# Altium project CourseEN.PrjPcb (part 2 of 2)
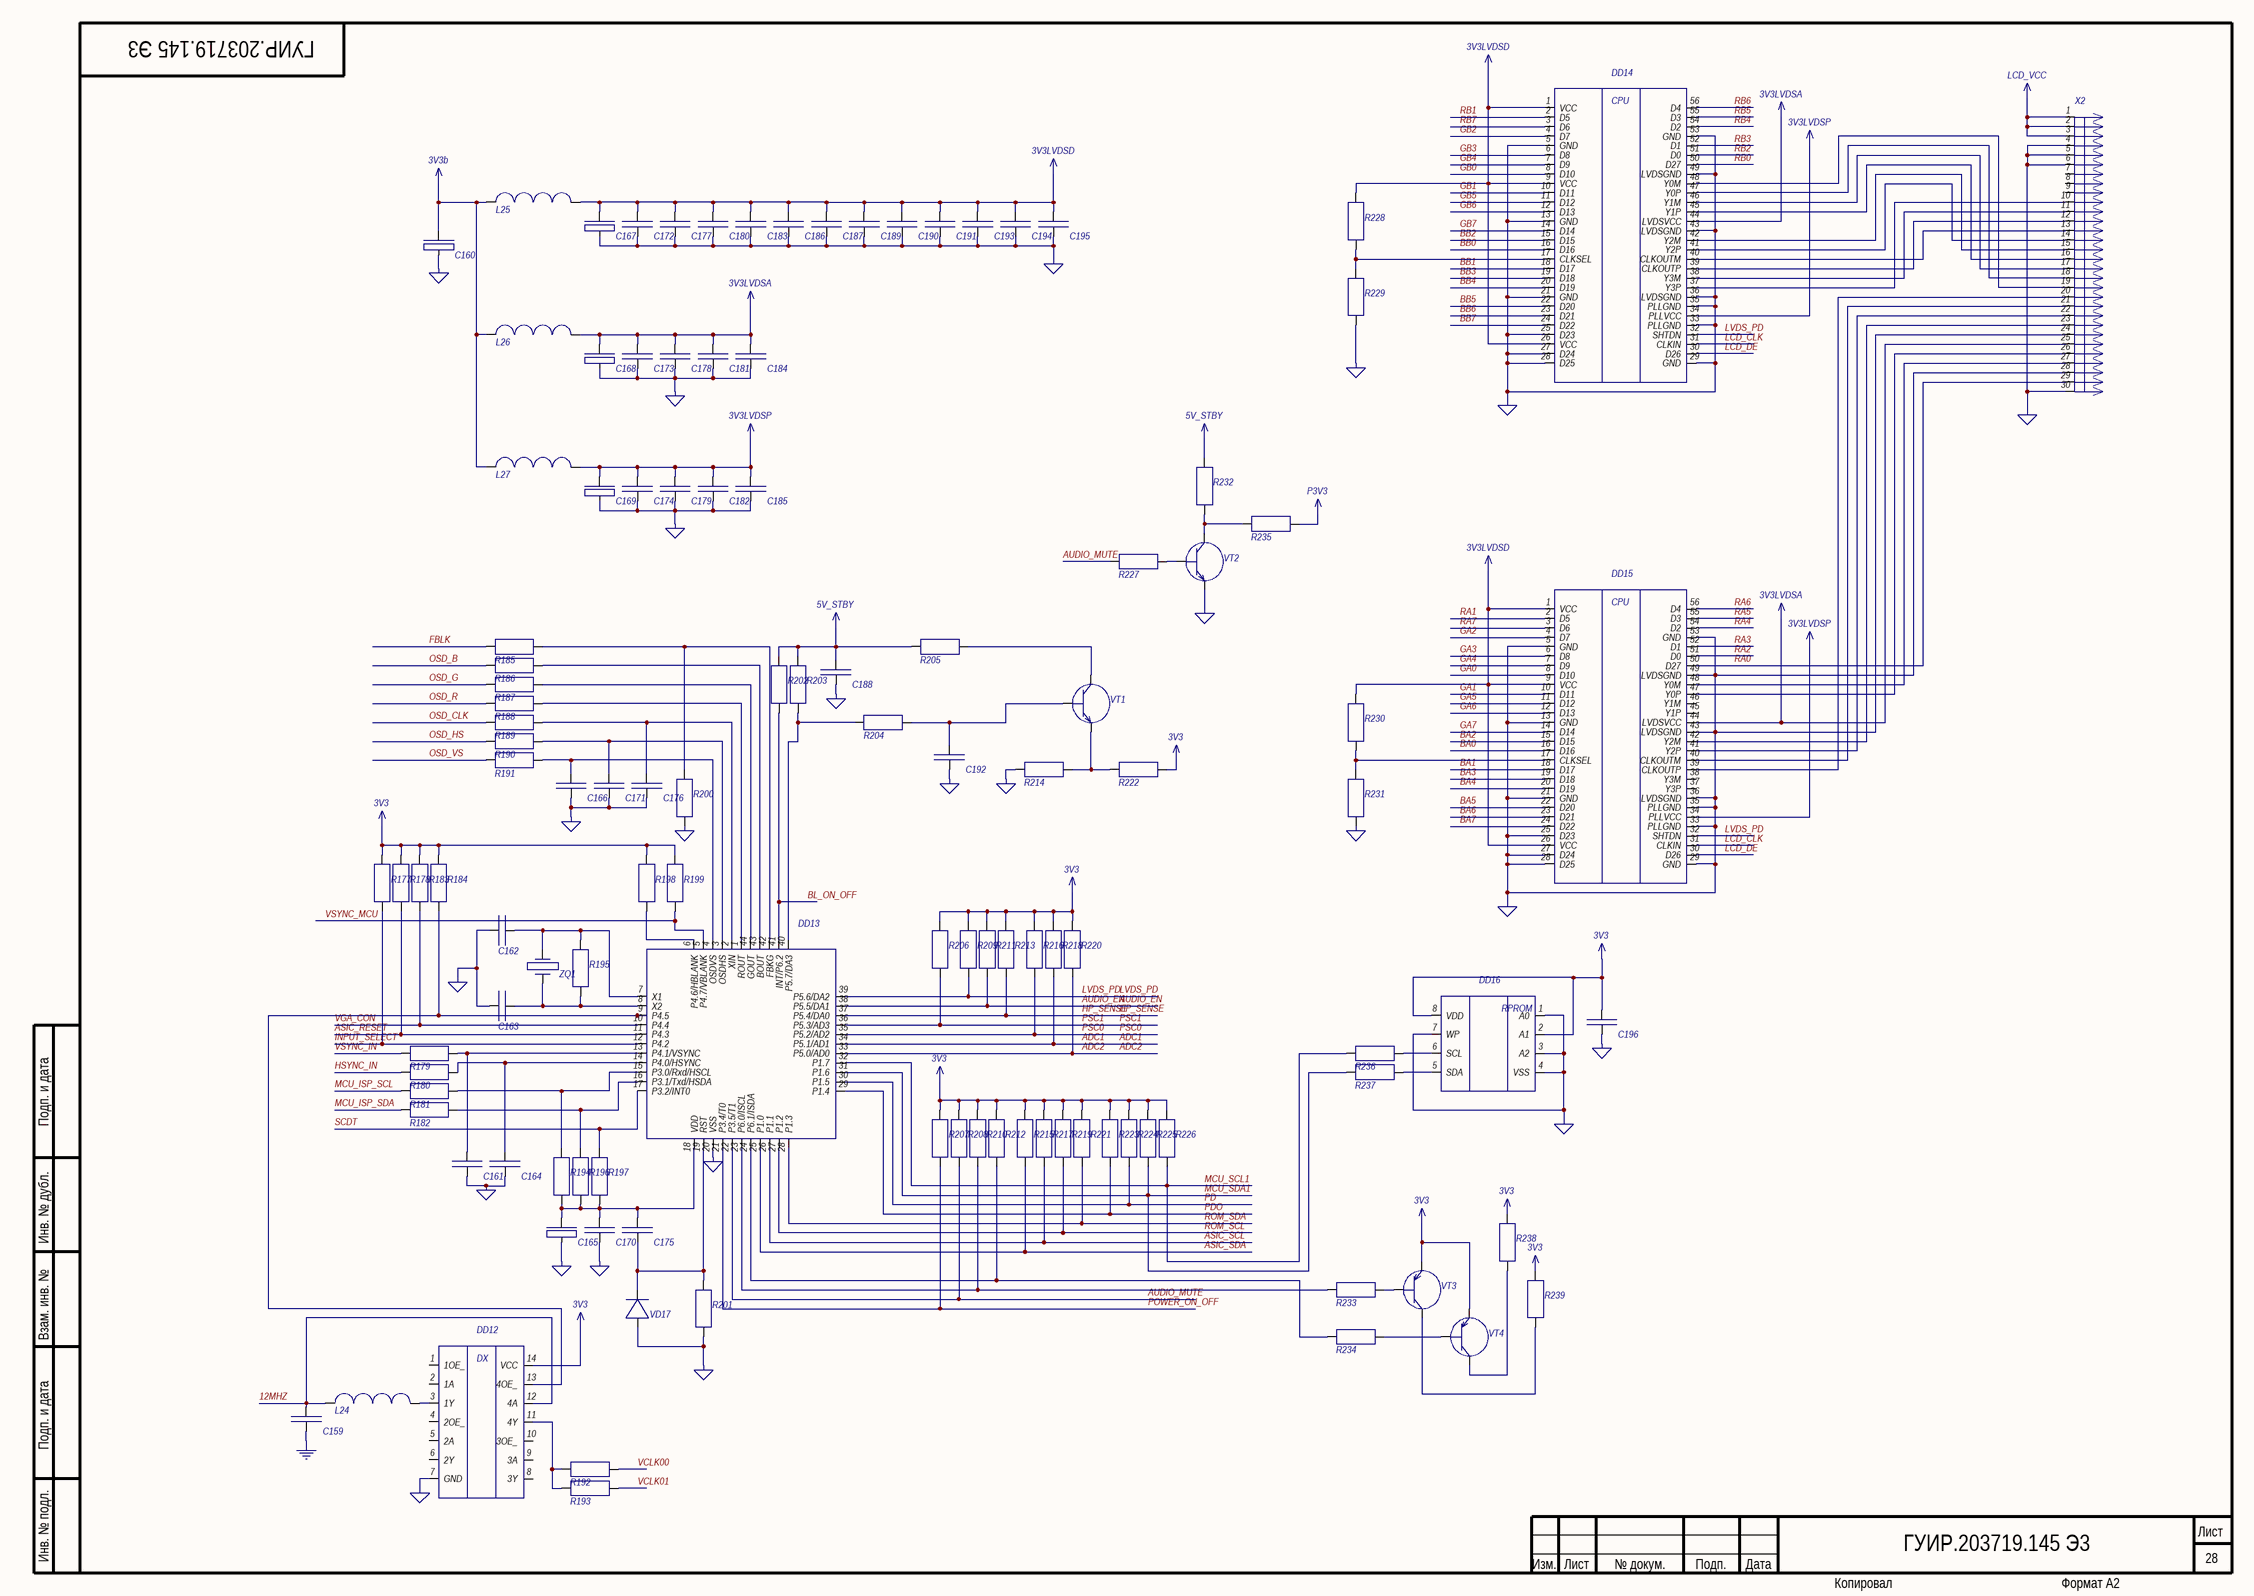
[diagram p4: 36.SchDoc]

## Nets that join several sheets
3V3: 31 (DD2.14 L1.2 L7.2 L12.2), 33 (C93.2 DD10.8 R117.1 R118.1), 36 (34 pins)
3V3b: 32 (C66.1 L20.1 L21.1 L22.1), 33 (L23.1), 36 (C160.1 L25.1 L26.1 L27.1)
3V3LVDSA: 32 (6 pins), 36 (9 pins)
3V3LVDSD: 32 (14 pins), 36 (22 pins)
3V3LVDSP: 32 (6 pins), 36 (8 pins)
5V_STBY: 31 (10 pins), 32 (VD16.1), 36 (5 pins)
ASIC_H: 31 (C40.1 L9.2), 33 (R115.2)
ASIC_RESET: 32 (DD9.9), 33 (DD10.7 R125.2), 36 (DD13.11 R178.1)
DE_IN: 32 (R102.2), 33 (DD11.159)
FCLK1: 32 (DD7.1), 33 (DD11.29)
GND: 31 (82 pins), 32 (76 pins), 33 (88 pins), 36 (82 pins)
HSYNC_X: 32 (DD5.2 R52.1), 33 (DD11.41)
INPUT_SELECT: 32 (DD9.10 DD9.11), 36 (DD13.12 R177.1)
MCU_H_IN: 31 (L11.2), 32 (DD9.13)
MCU_V_IN: 31 (L10.2), 32 (DD9.1)
OSD_CLK: 32 (C58.1 R62.2 R63.2), 33 (DD11.30), 36 (R189.2)
P3V3: 31 (8 pins), 32 (R54.1 R55.1), 36 (R235.2)
ROM_SCL: 32 (R112.1), 33 (R119.2), 36 (DD13.27 R219.2)
ROM_SCL_ASIC: 32 (R113.1), 33 (DD11.10 R119.1 R123.1)
VCLK01: 32 (R103.2), 33 (R176.1), 36 (R193.2)
VSYNC_MCU: 31 (R18.1), 33 (R116.2), 36 (DD13.5 R199.1)
12MHZ: 33 (DD11.16), 36 (C159.1 DD12.12 L24.1)
ASIC_SCL: 33 (R121.2), 36 (DD13.26 R217.2)
ASIC_SDA: 33 (R122.2), 36 (DD13.25 R215.2)
B_INA0: 31 (R32.2), 33 (DD11.147)
B_INA1: 31 (R31.2), 33 (DD11.148)
B_INA2: 31 (R30.2), 33 (DD11.149)
B_INA3: 31 (R29.2), 33 (DD11.151)
B_INA4: 31 (R28.2), 33 (DD11.152)
B_INA5: 31 (R27.2), 33 (DD11.153)
B_INA6: 31 (R26.2), 33 (DD11.154)
B_INA7: 31 (R25.2), 33 (DD11.155)
B_INB0: 32 (R77.2 R101.2), 33 (DD11.1)
B_INB1: 32 (R76.2 R100.2), 33 (DD11.2)
B_INB2: 32 (R75.2 R99.2), 33 (DD11.3)
B_INB3: 32 (R74.2 R98.2), 33 (DD11.4)
B_INB4: 32 (R73.2 R97.2), 33 (DD11.6)
B_INB5: 32 (R72.2 R96.2), 33 (DD11.7)
B_INB6: 32 (R71.2 R95.2), 33 (DD11.8)
B_INB7: 32 (R70.2 R94.2), 33 (DD11.9)
BA0: 33 (C148.2 R143.1), 36 (DD15.16)
BA1: 33 (C145.2 R142.1), 36 (DD15.18)
BA2: 33 (C142.2 R141.1), 36 (DD15.15)
BA3: 33 (C139.2 R140.1), 36 (DD15.19)
BA4: 33 (C136.2 R139.1), 36 (DD15.20)
BA5: 33 (C133.2 R138.1), 36 (DD15.22)
BA6: 33 (C130.2 R135.1), 36 (DD15.23)
BA7: 33 (C126.2 R134.1), 36 (DD15.24)
BB0: 33 (C122.2 R133.1), 36 (DD14.16)
BB1: 33 (C117.2 R132.1), 36 (DD14.18)
BB2: 33 (C113.2 R131.1), 36 (DD14.15)
BB3: 33 (C109.2 R130.1), 36 (DD14.19)
BB4: 33 (C107.2 R129.1), 36 (DD14.20)
BB5: 33 (C105.2 R128.1), 36 (DD14.22)
BB6: 33 (C103.2 R127.1), 36 (DD14.23)
BB7: 33 (C101.2 R126.1), 36 (DD14.24)
FBLK: 33 (DD11.23), 36 (R185.2)
G_INA0: 31 (R40.2), 33 (DD11.125)
G_INA1: 31 (R39.2), 33 (DD11.126)
G_INA2: 31 (R38.2), 33 (DD11.127)
G_INA3: 31 (R37.2), 33 (DD11.128)
G_INA4: 31 (R36.2), 33 (DD11.130)
G_INA5: 31 (R35.2), 33 (DD11.131)
G_INA6: 31 (R34.2), 33 (DD11.133)
G_INA7: 31 (R33.2), 33 (DD11.134)
G_INB0: 32 (R85.2 R93.2), 33 (DD11.136)
G_INB1: 32 (R84.2 R92.2), 33 (DD11.137)
G_INB2: 32 (R83.2 R91.2), 33 (DD11.139)
G_INB3: 32 (R82.2 R90.2), 33 (DD11.140)
G_INB4: 32 (R81.2 R89.2), 33 (DD11.142)
G_INB5: 32 (R80.2 R88.2), 33 (DD11.143)
G_INB6: 32 (R79.2 R87.2), 33 (DD11.144)
G_INB7: 32 (R78.2 R86.2), 33 (DD11.145)
GA0: 33 (C157.2 R159.1), 36 (DD15.8)
GA1: 33 (C155.2 R158.1), 36 (DD15.10)
GA2: 33 (C153.2 R157.1), 36 (DD15.4)
GA3: 33 (C151.2 R156.1), 36 (DD15.6)
GA4: 33 (C149.2 R155.1), 36 (DD15.7)
GA5: 33 (C146.2 R154.1), 36 (DD15.11)
GA6: 33 (C143.2 R153.1), 36 (DD15.12)
GA7: 33 (C140.2 R152.1), 36 (DD15.14)
GB0: 33 (C137.2 R151.1), 36 (DD14.8)
GB1: 33 (C134.2 R150.1), 36 (DD14.10)
GB2: 33 (C131.2 R149.1), 36 (DD14.4)
GB3: 33 (C127.2 R148.1), 36 (DD14.6)
GB4: 33 (C123.2 R147.1), 36 (DD14.7)
GB5: 33 (C118.2 R146.1), 36 (DD14.11)
GB6: 33 (C114.2 R145.1), 36 (DD14.12)
GB7: 33 (C110.2 R144.1), 36 (DD14.14)
HSYNC_IN: 32 (DD9.14), 36 (R180.1)
LCD_CLK: 33 (R137.1), 36 (DD14.31 DD15.31)
LCD_DE: 33 (R136.1), 36 (DD14.30 DD15.30)
MCU_ISP_SCL: 31 (R12.1), 36 (R181.1)
MCU_ISP_SDA: 31 (R13.1), 36 (R182.1)
MCU_SCL1: 31 (R24.1), 36 (DD13.32 R226.2 R236.1)
MCU_SDA1: 31 (R23.1), 36 (DD13.31 R225.2 R237.1)
OSD_B: 33 (DD11.22), 36 (R186.2)
OSD_G: 33 (DD11.21), 36 (R187.2)
OSD_HS: 33 (DD11.31), 36 (R190.2)
OSD_R: 33 (DD11.20), 36 (R188.2)
OSD_VS: 33 (DD11.32), 36 (R191.2)
PD: 32 (DD8.2), 36 (DD13.30 R224.2)
PDO: 32 (R59.2), 36 (DD13.29 R223.2)
R_INA0: 31 (R48.2), 33 (DD11.105)
R_INA1: 31 (R47.2), 33 (DD11.106)
R_INA2: 31 (R46.2), 33 (DD11.107)
R_INA3: 31 (R45.2), 33 (DD11.108)
R_INA4: 31 (R44.2), 33 (DD11.110)
R_INA5: 31 (R43.2), 33 (DD11.111)
R_INA6: 31 (R42.2), 33 (DD11.112)
R_INA7: 31 (R41.2), 33 (DD11.113)
R_INB0: 32 (R69.2 R111.2), 33 (DD11.114)
R_INB1: 32 (R68.2 R110.2), 33 (DD11.115)
R_INB2: 32 (R67.2 R109.2), 33 (DD11.117)
R_INB3: 32 (R65.2 R108.2), 33 (DD11.118)
R_INB4: 32 (R64.2 R107.2), 33 (DD11.120)
R_INB5: 32 (R60.2 R106.2), 33 (DD11.121)
R_INB6: 32 (R57.2 R105.2), 33 (DD11.122)
R_INB7: 32 (R56.2 R104.2), 33 (DD11.123)
RA0: 33 (C158.2 R175.1), 36 (DD15.50 X2.29)
RA1: 33 (C156.2 R174.1), 36 (DD15.2)
RA2: 33 (C154.2 R173.1), 36 (DD15.51)
RA3: 33 (C152.2 R172.1), 36 (DD15.52)
RA4: 33 (C150.2 R171.1), 36 (DD15.54)
RA5: 33 (C147.2 R170.1), 36 (DD15.55)
RA6: 33 (C144.2 R169.1), 36 (DD15.56)
RA7: 33 (C141.2 R168.1), 36 (DD15.3)
RB0: 33 (C138.2 R167.1), 36 (DD14.50)
RB1: 33 (C135.2 R166.1), 36 (DD14.2)
RB2: 33 (C132.2 R165.1), 36 (DD14.51)
RB3: 33 (C128.2 R164.1), 36 (DD14.52)
RB4: 33 (C124.2 R163.1), 36 (DD14.54)
RB5: 33 (C119.2 R162.1), 36 (DD14.55)
RB6: 33 (C115.2 R161.1), 36 (DD14.56)
RB7: 33 (C111.2 R160.1), 36 (DD14.3)
ROM_SCL_EEPROM: 32 (R114.2), 33 (DD10.6 R117.2 R123.2)
ROM_SDA: 33 (R120.2), 36 (DD13.28 R221.2)
SCDT: 32 (R58.2), 36 (DD13.17 R197.2)
VCLK00: 33 (DD11.28), 36 (R192.2)
VGA_CON: 31 (R8.2), 36 (DD13.10 R183.1)
VSYNC_IN: 32 (DD9.15), 36 (R179.1)